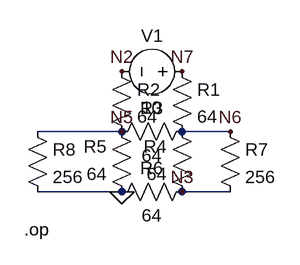
[diagram p0: schematic circuit-test.asc]
circuit-test.asc, the LTspice schematic file:
Version 4
SHEET 1 880 680
WIRE 128 192 16 192
WIRE 272 192 208 192
WIRE 128 272 16 272
WIRE 272 272 208 272
FLAG 272 192 N6
FLAG 128 192 N5
FLAG 208 112 N7
FLAG 128 112 N2
FLAG 208 272 N3
FLAG 128 272 0
SYMBOL voltage 224 112 R90
WINDOW 0 -32 56 VBottom 2
WINDOW 3 32 56 VTop 2
WINDOW 123 0 0 Left 0
WINDOW 39 0 0 Left 0
SYMATTR InstName V1
SYMATTR Value 10
SYMBOL res 192 96 R0
SYMATTR InstName R1
SYMATTR Value 64
SYMBOL res 112 96 R0
SYMATTR InstName R2
SYMATTR Value 64
SYMBOL res 224 176 R90
WINDOW 0 0 56 VBottom 2
WINDOW 3 32 56 VTop 2
SYMATTR InstName R3
SYMATTR Value 64
SYMBOL res 224 288 R180
WINDOW 0 36 76 Left 2
WINDOW 3 36 40 Left 2
SYMATTR InstName R4
SYMATTR Value 64
SYMBOL res 144 288 R180
WINDOW 0 36 76 Left 2
WINDOW 3 36 40 Left 2
SYMATTR InstName R5
SYMATTR Value 64
SYMBOL res 112 288 R270
WINDOW 0 32 56 VTop 2
WINDOW 3 0 56 VBottom 2
SYMATTR InstName R6
SYMATTR Value 64
SYMBOL res 256 176 R0
SYMATTR InstName R7
SYMATTR Value 256
SYMBOL res 0 176 R0
SYMATTR InstName R8
SYMATTR Value 256
TEXT -2 322 Left 2 !.op

The netlist it stands for:
* circuit-test.asc
V1 N7 N2 10
R1 N7 N6 64
R2 N2 N5 64
R3 N6 N5 64
R4 N3 N6 64
R5 0 N5 64
R6 0 N3 64
R7 N6 N3 256
R8 N5 0 256
.op
.backanno
.end